# Altium schematic sheet RS485.SchDoc: RS485 Transceiver
size A4; Author: Jason Zhou; Engineer: Jason Zhou; SheetNumber: 5; SheetTotal: 6; projectidentifier: V5 Co-proccessor; SPICEModelCacheHKPDKEBW: <root> / <DocumentId>HKPDKEBW</DocumentId> / </root>
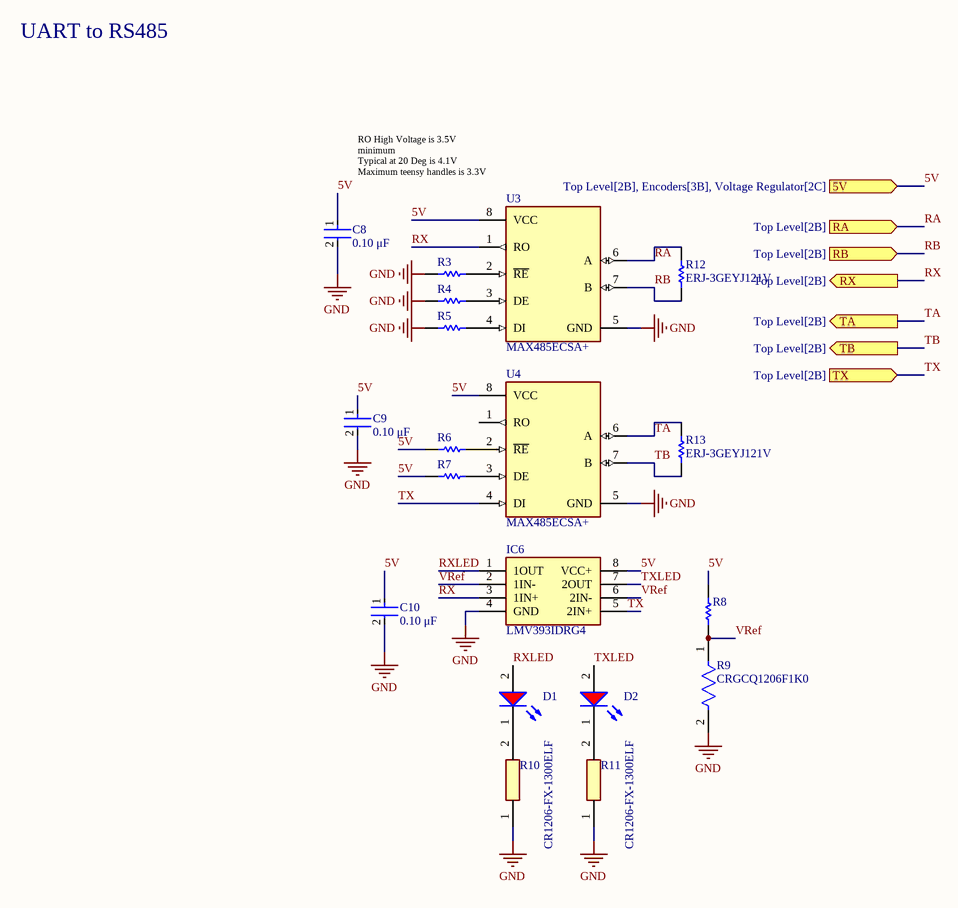
[diagram p0: RS485.SchDoc]

## Parts
C8  Capacitance: 0.10 μF  [FP-C1206C-EB-MFG]  (hidden comment: C1206C104M5RACTU)
C9  Capacitance: 0.10 μF  [FP-C1206C-EB-MFG]  (hidden comment: C1206C104M5RACTU)
C10  Capacitance: 0.10 μF  [FP-C1206C-EB-MFG]  (hidden comment: C1206C104M5RACTU)
D1  150120RS75000  [WL-SMCW_1206_150120xx75000]  (value not drawn)
D2  150120RS75000  [WL-SMCW_1206_150120xx75000]  (value not drawn)
IC6  LMV393IDRG4  [SOIC127P600X175-8N]
R3  RK73H2BTTD4701F  [RESC3216X70X40NL20T20]  (value not drawn)
R4  RK73H2BTTD4701F  [RESC3216X70X40NL20T20]  (value not drawn)
R5  RK73H2BTTD4701F  [RESC3216X70X40NL20T20]  (value not drawn)
R6  RK73H2BTTD4701F  [RESC3216X70X40NL20T20]  (value not drawn)
R7  RK73H2BTTD4701F  [RESC3216X70X40NL20T20]  (value not drawn)
R8  RK73B2BTTD222J  [RESC3216X70X40LL20T20]  (value not drawn)
R9  CRGCQ1206F1K0  [FP-CRGCQ1206-IPC_C]
R10  CR1206-FX-1300ELF  [RESC3216X75N]
R11  CR1206-FX-1300ELF  [RESC3216X75N]
R12  ERJ-3GEYJ121V  [RESC1608X55X30LL15T15]
R13  ERJ-3GEYJ121V  [RESC1608X55X30LL15T15]
U3  MAX485ECSA+  [FP-S8-5-MFG]
U4  MAX485ECSA+  [FP-S8-5-MFG]

## Ports
5V (in, see Top Level[2B], Encoders[3B], Voltage Regulator[2C]), RA (in, see Top Level[2B]), RB (in, see Top Level[2B]), RX (out, see Top Level[2B]), TA (out, see Top Level[2B]), TB (out, see Top Level[2B]), TX (in, see Top Level[2B])

## Nets
GND: C8.2 C9.2 C10.2 IC6.4(GND) R3.2 R4.2 R5.2 R9.2 R10.1 R11.1 U3.5(GND) U4.5(GND)
5V: C8.1 C9.1 C10.1 IC6.8(VCC+) R6.2 R7.2 R8.2 U3.8(VCC) U4.8(VCC) ; port 5V
RA: R12.2 U3.6(A) ; port RA
RB: R12.1 U3.7(B) ; port RB
RX: IC6.3(1IN+) U3.1(RO) ; port RX
RXLED: D1.2(A) IC6.1(1OUT)
TA: R13.2 U4.6(A) ; port TA
TB: R13.1 U4.7(B) ; port TB
TX: IC6.5(2IN+) U4.4(DI) ; port TX
TXLED: D2.2(A) IC6.7(2OUT)
VRef: IC6.2(1IN-) IC6.6(2IN-) R8.1 R9.1
NetD1_1: D1.1(K) R10.2
NetD2_1: D2.1(K) R11.2
NetR3_1: R3.1 U3.2(~{RE})
NetR4_1: R4.1 U3.3(DE)
NetR5_1: R5.1 U3.4(DI)
NetR6_1: R6.1 U4.2(~{RE})
NetR7_1: R7.1 U4.3(DE)

Not connected (* = marked no-connect by the designer): U4 1(RO)

## Notes on the sheet
- UART to RS485
- RO High Voltage is 3.5V minimum
  Typical at 20 Deg is 4.1V
  Maximum teensy handles is 3.3V
- Size:
- Date:
- Title
- A4
- Project:
- Time:
- Revision:
- Sheet
- of
- Engineer
- File:

## Library data of the parts
C8-C10 = CMP-03020-028488-1: CAP CER 0.1UF 50V X7R 1206; Manufacturer: KEMET; Material: Ceramic; Automotive Grade: Grade 0; Value: 0.10 μF; Tolerance: 0.2; Temperature Coefficient: 15%; Device Class L3: Ceramic Capacitors; Device Class L1: Passive Components; Category: Cap; Octopart: https://octopart.com/c1206c104m5ractu-kemet-129344; Temperature Range Low: -55°C; RoHS: TRUE; Manufacturer Part Number: C1206C104M5RACTU; Lead Free: Yes; Package: C1206C-EB; Digikey Description: CAP CER 0.1UF 50V X7R 1206; Automotive: Yes; Height: 0.88mm; Device Class L2: Capacitors; ComponentLink2Description: Datasheet; Mouser Description: Multilayer Ceramic Capacitors MLCC - SMD/SMT 50volts 0.1uF X7R 20%; Temperature: -55°C to +150°C; Temperature Characteristic: X7R; ComponentLink2URL: https://content.kemet.com/datasheets/KEM_C1007_X8R_ULTRA_150C_SMD.pdf; Ipc Land Pattern Name: CAPC320160X78; Temperature Range High: +150°C; Voltage Rating: 50 V
D1 D2 = CMP-1426-00013-3: NexarPartId: 29717788; Dominant Wavelength: 625nm; Max Reverse Voltage (DC): 5V; Luminous Intensity: 150mcd; Color: Red; Peak Wavelength: 630nm; Test Current: 20mA; Max Junction Temperature (Tj): 95°C; Power Dissipation: 72mW; Viewing Angle: 140°; Forward Voltage: 2V; Lens Style: Clear, Rectangular; Forward Current: 100mA; Mount: Surface Mount; Wavelength: 625nm; REACH SVHC: Unknown; Case Code (Imperial): 1206; Case Code (Metric): 3216; RoHS: Compliant; Width: 1.6mm; Min Operating Temperature: -40°C; Reverse Voltage: 5V; Max Operating Temperature: 85°C; Case/Package: 1206; Height: 680µm; Length: 3.2mm; Packaging: Tape and Reel
IC6 = LMV393IDRG4: Integrated Circuit; Manufacturer_Name: Texas Instruments; Datasheet Link: https://www.ti.com/lit/gpn/lmv393; Height: 1.75mm; Manufacturer_Part_Number: LMV393IDRG4; Mouser Part Number: 595-LMV393IDRG4; Mouser Price/Stock: https://www.mouser.co.uk/ProductDetail/Texas-Instruments/LMV393IDRG4?qs=tP77tliwutC5frth4oKpcg%3D%3D; Arrow Part Number: LMV393IDRG4; Arrow Price/Stock: https://www.arrow.com/en/products/lmv393idrg4/texas-instruments?region=nac
R3-R7 = CMP-2003-01471-1: Manufacturer: KOA Speer; Part Number: RK73H2BTTD4701F
R8 = CMP-2003-04576-1: Manufacturer: KOA Speer; Value: 2.2k; Part Number: RK73B2BTTD222J
R9 = CMP-03211-006592-1: CRGCQ1206 1KΩ 0.25W 1% ±100ppm/°C 200V; Manufacturer: TE Connectivity; Automotive Grade: Grade 685; Tolerance: 0.01; Ipc Land Pattern Name: RESC310155X55; Temperature Range Low: -55°C; Device Class L3: Chip SMD Resistors; ComponentLink2URL: https://www.te.com/commerce/DocumentDelivery/DDEController?Action=showdoc&DocId=Data+Sheet%7F1773204-3%7F1%7Fpdf%7FEnglish%7FENG_DS_1773204-3_1.pdf%7F4-2176347-694; Automotive: Yes; Temperature: -55°C to +155°C; Manufacturer Part Number: CRGCQ1206F1K0; Package: CRGCQ1206; Octopart: https://octopart.com/crgcq1206f1k0-te+connectivity-91018258; Device Class L1: Passive Components; Series: CRGCQ; Device Class L2: Resistors; RoHS: TRUE; Lead Free: Yes; ComponentLink2Description: Datasheet; Power Rating: 0.25W; Temperature Coefficient: ±100ppm/°C; Value: 1KΩ; Voltage Rating: 200V; Temperature Range High: +155°C; Height: 0.65mm; Category: Res; Resistance: 1KΩ; Composition: Thick Film; Ambient Temperature Range High: +70°C
R10 R11 = CR1206-FX-1300ELF: Resistor; Manufacturer_Name: Bourns; Datasheet Link: http://www.bourns.com/data/global/pdfs/CHPREZTR.pdf; Height: 0.75mm; Manufacturer_Part_Number: CR1206-FX-1300ELF; Mouser Part Number: 652-CR1206FX-1300ELF; Mouser Price/Stock: http://www.mouser.com/Search/ProductDetail.aspx?qs=3wWX5hyYeeSCpYLK5R9snA%3d%3d
R12 R13 = CMP-2000-00713-1: Manufacturer: Panasonic; Part Number: ERJ-3GEYJ121V
U3 U4 = CMP-05679-000003-1: IC TXRX RS485/RS422 8-SOIC; Manufacturer: Maxim Integrated; Number Of Receivers: 1; Simplex Duplex: Half Duplex; Data Rate: 2.5Mbits/s; Nominal Supply Current: 300-500uA; Standoff Height: 0.1mm; Min Supply Voltage: 4.75V; Max Supply Voltage: 5.25V; Interface: RS-485,RS-422; Device Class L3: RS-232 / RS-422 / RS-485 Interface ICs; Temperature Range Low: 0°C; Automotive: No; Temperature: 0°C to +70°C; Digikey Description: IC TXRX RS485/RS422 8-SOIC; ComponentLink2URL: https://datasheets.maximintegrated.com/en/ds/MAX1487E-MAX491E.pdf; Lead Free: Yes; Manufacturer Part Number: MAX485ECSA+; Device Class L1: Integrated Circuits (ICs); Device Class L2: Interface ICs; RoHS: TRUE; ComponentLink2Description: Datasheet; Category: IC; Package: S8-5; Octopart: https://octopart.com/max485ecsa%2B-maxim+integrated-39397871; Footprint Url: https://pdfserv.maximintegrated.com/land_patterns/90-0096.PDF; Mouser Description: MAX485E Series 2.5 Mbps 12 V Half-Duplex SMT RS 485 Transceiver - SOIC-8; Temperature Range High: +70°C; Number Of Transmitters: 1; Height: 1.75mm